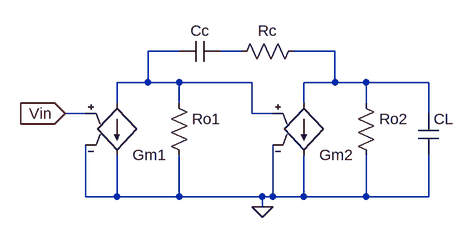
[diagram p0: schematic small-signal.asc]
small-signal.asc, the LTspice schematic file:
Version 4
SHEET 1 880 680
WIRE 144 32 96 32
WIRE 240 32 208 32
WIRE 384 32 320 32
WIRE 96 80 96 32
WIRE 96 80 48 80
WIRE 144 80 96 80
WIRE 256 80 144 80
WIRE 384 80 384 32
WIRE 384 80 336 80
WIRE 432 80 384 80
WIRE 528 80 432 80
WIRE 48 112 48 80
WIRE 144 112 144 80
WIRE 336 112 336 80
WIRE 432 112 432 80
WIRE 0 128 -32 128
WIRE 256 128 256 80
WIRE 288 128 256 128
WIRE 528 128 528 80
WIRE 0 256 0 176
WIRE 48 256 48 192
WIRE 48 256 0 256
WIRE 144 256 144 192
WIRE 144 256 48 256
WIRE 272 256 144 256
WIRE 288 256 288 176
WIRE 288 256 272 256
WIRE 336 256 336 192
WIRE 336 256 288 256
WIRE 432 256 432 192
WIRE 432 256 336 256
WIRE 528 256 528 192
WIRE 528 256 432 256
WIRE 272 272 272 256
FLAG -32 128 Vin
IOPIN -32 128 In
FLAG 272 272 0
SYMBOL res 128 96 R0
SYMATTR InstName Ro1
SYMATTR Value ""
SYMBOL res 416 96 R0
SYMATTR InstName Ro2
SYMATTR Value ""
SYMBOL g2 48 208 M180
SYMATTR InstName Gm1
SYMATTR Value ""
SYMBOL g2 336 208 M180
SYMATTR InstName Gm2
SYMATTR Value ""
SYMBOL cap 208 16 R90
WINDOW 0 0 32 VBottom 2
WINDOW 3 32 32 VTop 2
SYMATTR InstName Cc
SYMATTR Value ""
SYMBOL res 336 16 R90
WINDOW 0 0 56 VBottom 2
WINDOW 3 32 56 VTop 2
SYMATTR InstName Rc
SYMATTR Value ""
SYMBOL cap 512 128 R0
SYMATTR InstName CL
SYMATTR Value ""

The netlist it stands for:
* small-signal.asc
Ro1 N001 0
Ro2 N003 0
Gm1 N001 0 Vin 0
Gm2 N003 0 N001 0
Cc N002 N001
Rc N003 N002
CL N003 0
.backanno
.end